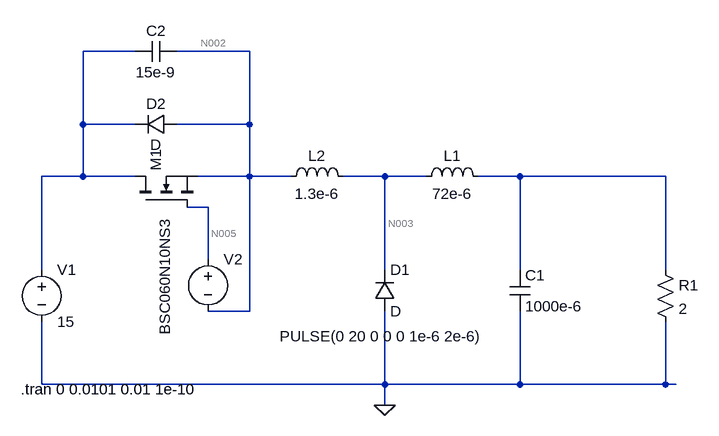
[diagram p0: schematic Draft2.asc]
Draft2.asc, the LTspice schematic file:
Version 4
SHEET 1 880 680
WIRE -96 -544 -176 -544
WIRE 80 -544 -32 -544
WIRE -176 -432 -176 -544
WIRE -96 -432 -176 -432
WIRE 80 -432 80 -544
WIRE 80 -432 -32 -432
WIRE -176 -352 -176 -432
WIRE -176 -352 -240 -352
WIRE -96 -352 -176 -352
WIRE 80 -352 80 -432
WIRE 80 -352 0 -352
WIRE 144 -352 80 -352
WIRE 288 -352 224 -352
WIRE 352 -352 288 -352
WIRE 496 -352 432 -352
WIRE 720 -352 496 -352
WIRE 16 -304 -16 -304
WIRE 16 -224 16 -304
WIRE -240 -208 -240 -352
WIRE 288 -208 288 -352
WIRE 496 -208 496 -352
WIRE 720 -208 720 -352
WIRE 80 -144 80 -352
WIRE 80 -144 16 -144
WIRE -240 -32 -240 -128
WIRE 288 -32 288 -144
WIRE 288 -32 -240 -32
WIRE 496 -32 496 -144
WIRE 496 -32 288 -32
WIRE 720 -32 720 -128
WIRE 720 -32 496 -32
WIRE 736 -32 720 -32
WIRE 288 0 288 -32
FLAG 288 0 0
SYMBOL nmos -96 -304 R270
WINDOW 3 -196 46 Left 2
SYMATTR Value BSC060N10NS3
SYMATTR InstName M1
SYMBOL voltage -240 -224 R0
WINDOW 123 0 0 Left 2
WINDOW 39 0 0 Left 2
SYMATTR InstName V1
SYMATTR Value 15
SYMBOL ind 336 -336 R270
WINDOW 0 32 56 VTop 2
WINDOW 3 5 56 VBottom 2
SYMATTR InstName L1
SYMATTR Value 72e-6
SYMBOL cap 480 -208 R0
SYMATTR InstName C1
SYMATTR Value 1000e-6
SYMBOL res 704 -224 R0
SYMATTR InstName R1
SYMATTR Value 2
SYMBOL diode 272 -144 M180
WINDOW 0 24 64 Left 2
WINDOW 3 24 0 Left 2
SYMATTR InstName D1
SYMBOL diode -32 -448 R90
WINDOW 0 0 32 VBottom 2
WINDOW 3 32 32 VTop 2
SYMATTR InstName D2
SYMBOL voltage 16 -240 R0
WINDOW 123 0 0 Left 2
WINDOW 39 0 0 Left 2
WINDOW 3 110 134 Left 2
SYMATTR Value PULSE(0 20 0 0 0 1e-6 2e-6)
SYMATTR InstName V2
SYMBOL ind 128 -336 R270
WINDOW 0 32 56 VTop 2
WINDOW 3 5 56 VBottom 2
SYMATTR InstName L2
SYMATTR Value 1.3e-6
SYMBOL cap -32 -560 R90
WINDOW 0 0 32 VBottom 2
WINDOW 3 32 32 VTop 2
SYMATTR InstName C2
SYMATTR Value 15e-9
TEXT -272 -24 Left 2 !.tran 0 0.0101 0.01 1e-10

The netlist it stands for:
* Draft2.asc
M1 N001 N005 N002 N002 BSC060N10NS3
V1 N001 0 15
L1 N003 N004 72e-6
C1 N004 0 1000e-6
R1 N004 0 2
D1 0 N003 D
D2 N002 N001 D
V2 N005 N002 PULSE(0 20 0 0 0 1e-6 2e-6)
L2 N002 N003 1.3e-6
C2 N002 N001 15e-9
.model D D
.lib standard.dio
.model NMOS NMOS
.model PMOS PMOS
.lib standard.mos
.tran 0 0.0101 0.01 1e-10
.backanno
.end

* Results of the author's LTspice run, read from the files saved beside the schematic
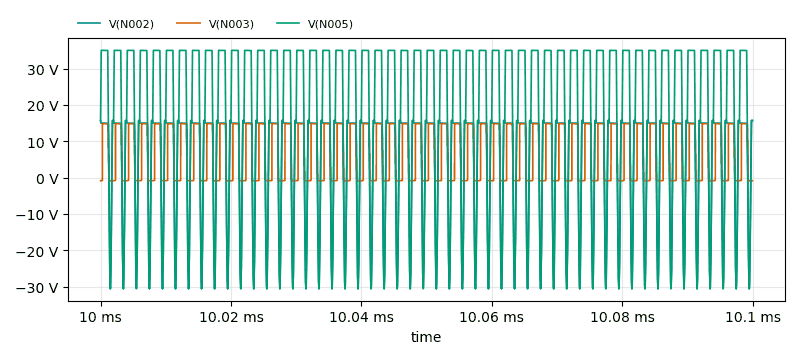
[diagram p1: Transient Analysis of Draft2.asc, plotted from the saved traces]
* Transient Analysis, 1 run:
*   V(N002): min -30.6 V, max 15.71 V, average 6.537 V, rms 16.46 V, last 15.69 V
*   V(N003): min -882.5 mV, max 14.83 V, average 6.523 V, rms 10.11 V, last -866.7 mV
*   V(N005): min -30.6 V, max 35 V, average 17.54 V, rms 28.53 V, last 15.69 V